# Altium schematic sheet Э3-10.SchDoc
size 594 x 420 mm; Address1: Address1; Address2: Address2; Address3: Address3; Address4: Address4; SheetNumber: 9; SheetTotal: 12; DocumentType: Схема электрическая принципиальная
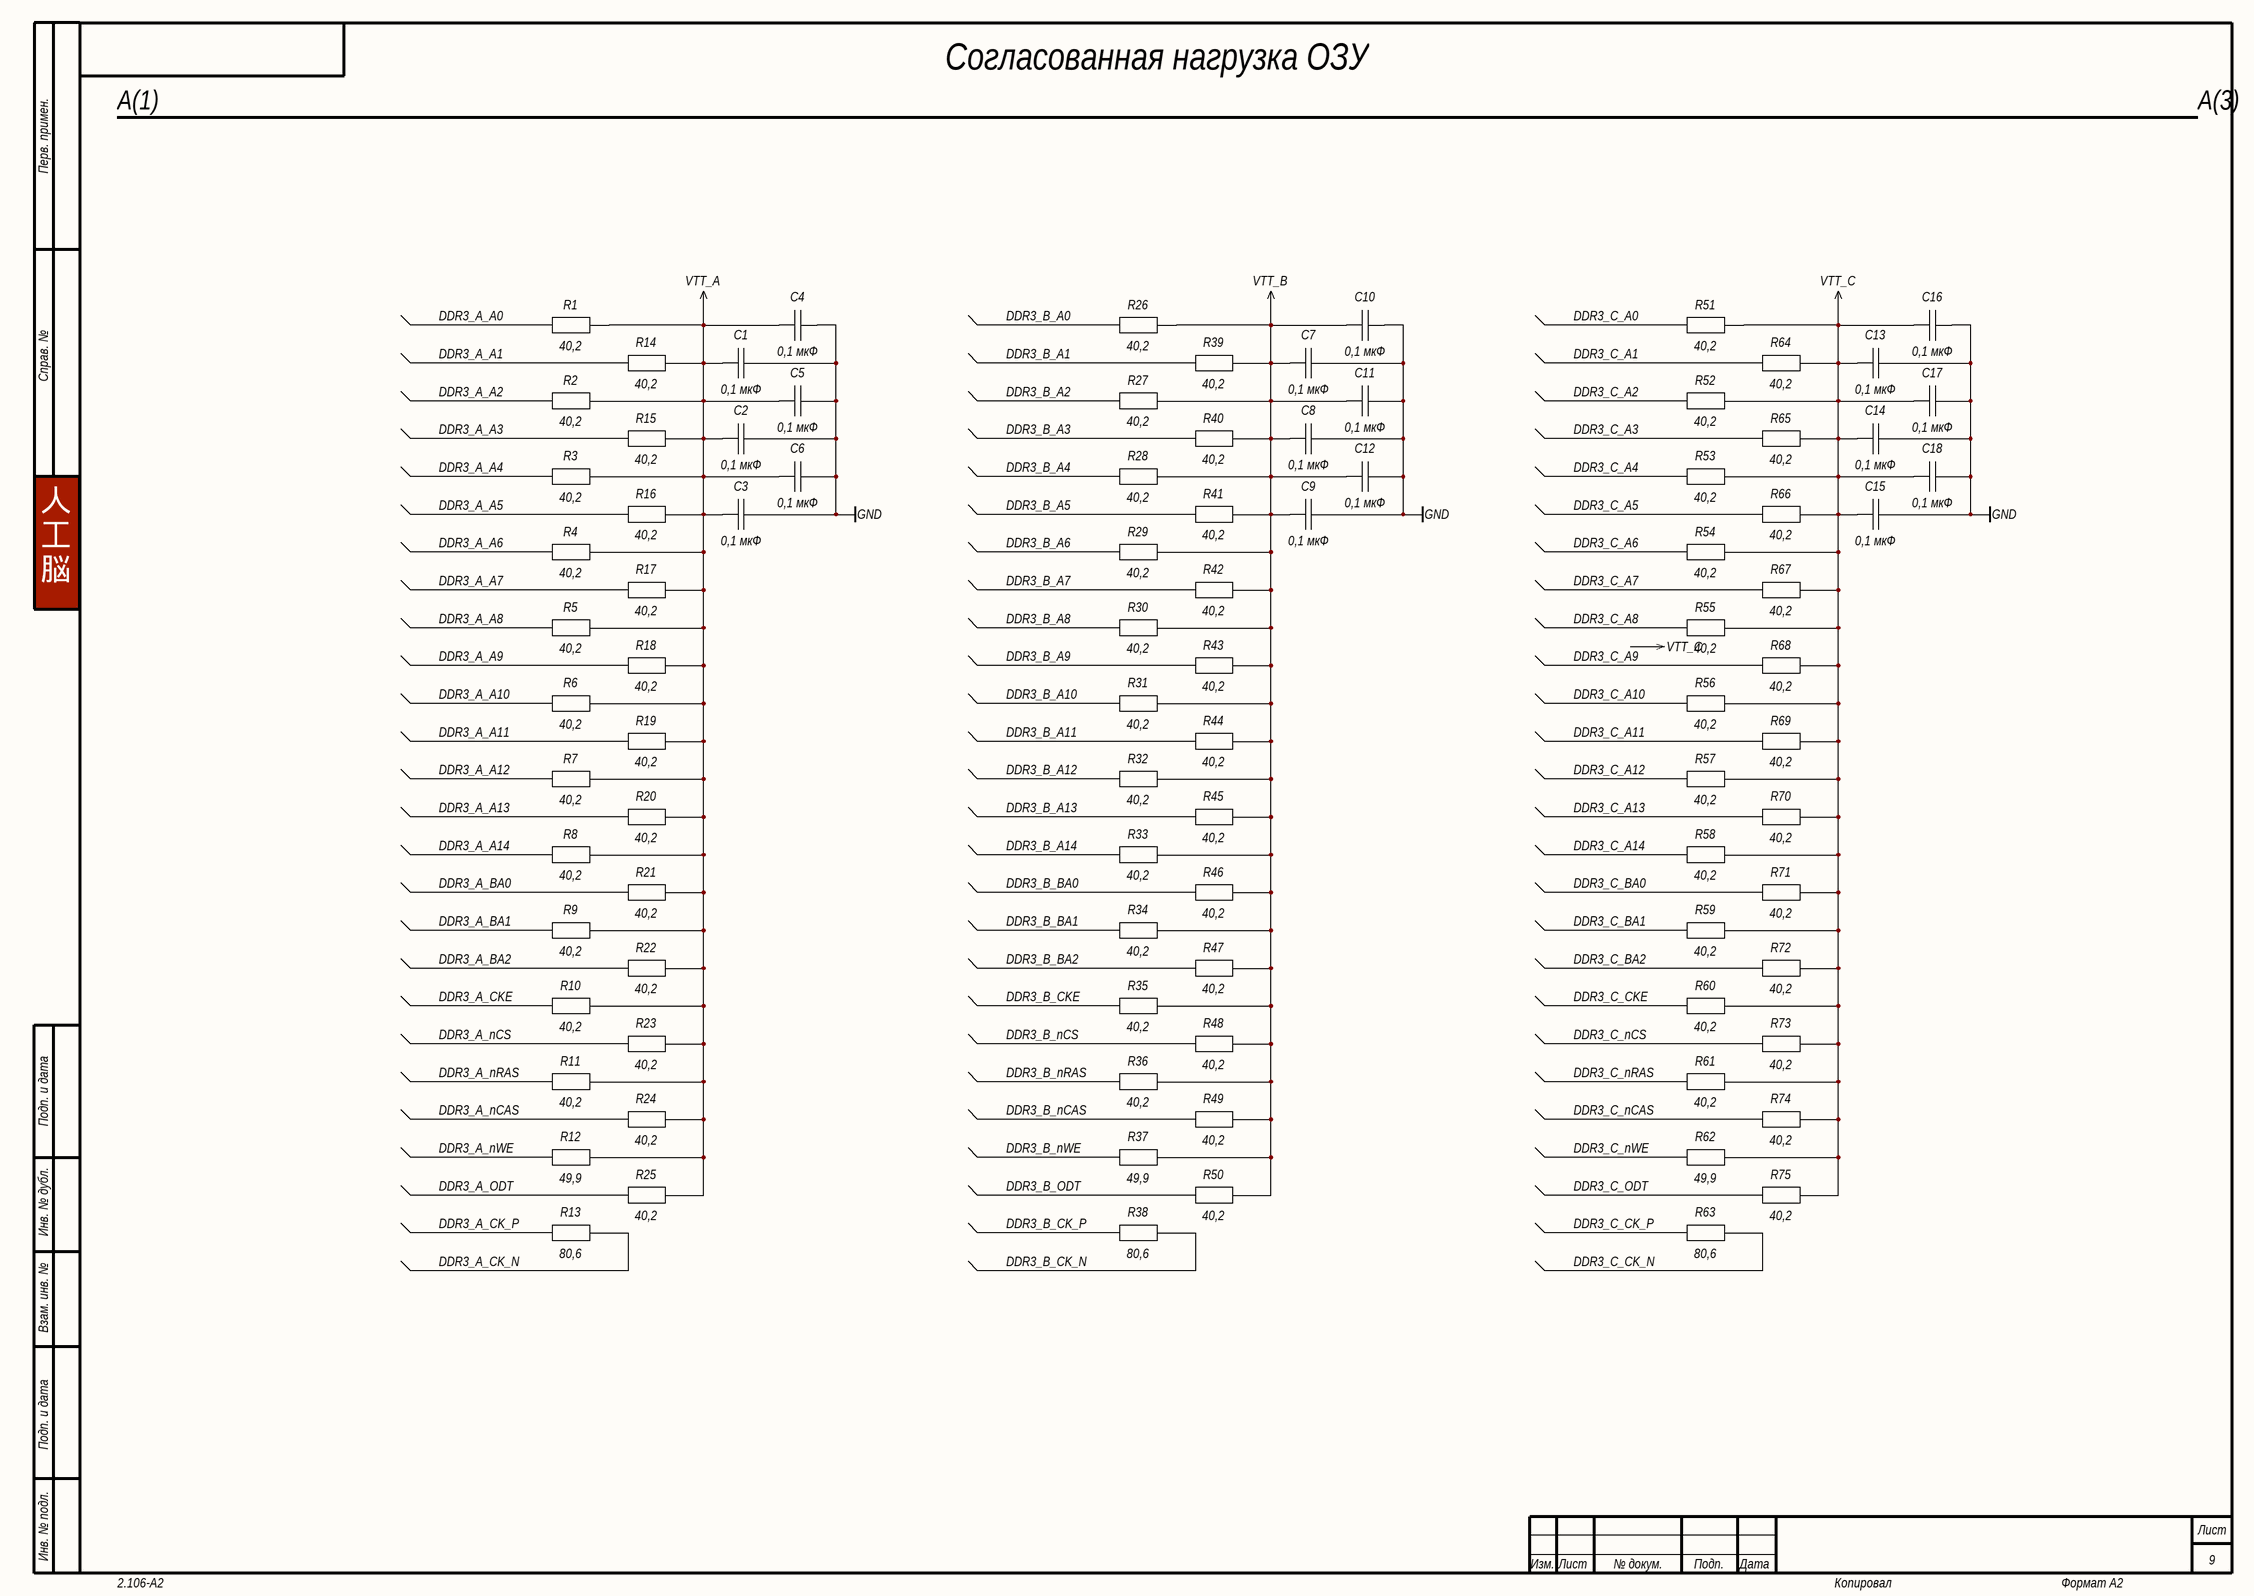
[diagram p0: Э3-10.SchDoc]

## Parts
C1  value 0,1 мкФ  [C0201-B-0.3mm]  (hidden comment: 1)
C2  value 0,1 мкФ  [C0201-B-0.3mm]  (hidden comment: 1)
C3  value 0,1 мкФ  [C0201-B-0.3mm]  (hidden comment: 1)
C4  value 0,1 мкФ  [C0201-B-0.3mm]  (hidden comment: 1)
C5  value 0,1 мкФ  [C0201-B-0.3mm]  (hidden comment: 1)
C6  value 0,1 мкФ  [C0201-B-0.3mm]  (hidden comment: 1)
C7  value 0,1 мкФ  [C0201-B-0.3mm]  (hidden comment: 1)
C8  value 0,1 мкФ  [C0201-B-0.3mm]  (hidden comment: 1)
C9  value 0,1 мкФ  [C0201-B-0.3mm]  (hidden comment: 1)
C10  value 0,1 мкФ  [C0201-B-0.3mm]  (hidden comment: 1)
C11  value 0,1 мкФ  [C0201-B-0.3mm]  (hidden comment: 1)
C12  value 0,1 мкФ  [C0201-B-0.3mm]  (hidden comment: 1)
C13  value 0,1 мкФ  [C0201-B-0.3mm]  (hidden comment: 1)
C14  value 0,1 мкФ  [C0201-B-0.3mm]  (hidden comment: 1)
C15  value 0,1 мкФ  [C0201-B-0.3mm]  (hidden comment: 1)
C16  value 0,1 мкФ  [C0201-B-0.3mm]  (hidden comment: 1)
C17  value 0,1 мкФ  [C0201-B-0.3mm]  (hidden comment: 1)
C18  value 0,1 мкФ  [C0201-B-0.3mm]  (hidden comment: 1)
R1  value 40,2  [CR0201-B-0.25mm]  (hidden comment: 1)
R2  value 40,2  [CR0201-B-0.25mm]  (hidden comment: 1)
R3  value 40,2  [CR0201-B-0.25mm]  (hidden comment: 1)
R4  value 40,2  [CR0201-B-0.25mm]  (hidden comment: 1)
R5  value 40,2  [CR0201-B-0.25mm]  (hidden comment: 1)
R6  value 40,2  [CR0201-B-0.25mm]  (hidden comment: 1)
R7  value 40,2  [CR0201-B-0.25mm]  (hidden comment: 1)
R8  value 40,2  [CR0201-B-0.25mm]  (hidden comment: 1)
R9  value 40,2  [CR0201-B-0.25mm]  (hidden comment: 1)
R10  value 40,2  [CR0201-B-0.25mm]  (hidden comment: 1)
R11  value 40,2  [CR0201-B-0.25mm]  (hidden comment: 1)
R12  value 49,9  [CR0201-B-0.25mm]  (hidden comment: 1)
R13  value 80,6  [CR0201-B-0.25mm]  (hidden comment: 1)
R14  value 40,2  [CR0201-B-0.25mm]  (hidden comment: 1)
R15  value 40,2  [CR0201-B-0.25mm]  (hidden comment: 1)
R16  value 40,2  [CR0201-B-0.25mm]  (hidden comment: 1)
R17  value 40,2  [CR0201-B-0.25mm]  (hidden comment: 1)
R18  value 40,2  [CR0201-B-0.25mm]  (hidden comment: 1)
R19  value 40,2  [CR0201-B-0.25mm]  (hidden comment: 1)
R20  value 40,2  [CR0201-B-0.25mm]  (hidden comment: 1)
R21  value 40,2  [CR0201-B-0.25mm]  (hidden comment: 1)
R22  value 40,2  [CR0201-B-0.25mm]  (hidden comment: 1)
R23  value 40,2  [CR0201-B-0.25mm]  (hidden comment: 1)
R24  value 40,2  [CR0201-B-0.25mm]  (hidden comment: 1)
R25  value 40,2  [CR0201-B-0.25mm]  (hidden comment: 1)
R26  value 40,2  [CR0201-B-0.25mm]  (hidden comment: 1)
R27  value 40,2  [CR0201-B-0.25mm]  (hidden comment: 1)
R28  value 40,2  [CR0201-B-0.25mm]  (hidden comment: 1)
R29  value 40,2  [CR0201-B-0.25mm]  (hidden comment: 1)
R30  value 40,2  [CR0201-B-0.25mm]  (hidden comment: 1)
R31  value 40,2  [CR0201-B-0.25mm]  (hidden comment: 1)
R32  value 40,2  [CR0201-B-0.25mm]  (hidden comment: 1)
R33  value 40,2  [CR0201-B-0.25mm]  (hidden comment: 1)
R34  value 40,2  [CR0201-B-0.25mm]  (hidden comment: 1)
R35  value 40,2  [CR0201-B-0.25mm]  (hidden comment: 1)
R36  value 40,2  [CR0201-B-0.25mm]  (hidden comment: 1)
R37  value 49,9  [CR0201-B-0.25mm]  (hidden comment: 1)
R38  value 80,6  [CR0201-B-0.25mm]  (hidden comment: 1)
R39  value 40,2  [CR0201-B-0.25mm]  (hidden comment: 1)
R40  value 40,2  [CR0201-B-0.25mm]  (hidden comment: 1)
R41  value 40,2  [CR0201-B-0.25mm]  (hidden comment: 1)
R42  value 40,2  [CR0201-B-0.25mm]  (hidden comment: 1)
R43  value 40,2  [CR0201-B-0.25mm]  (hidden comment: 1)
R44  value 40,2  [CR0201-B-0.25mm]  (hidden comment: 1)
R45  value 40,2  [CR0201-B-0.25mm]  (hidden comment: 1)
R46  value 40,2  [CR0201-B-0.25mm]  (hidden comment: 1)
R47  value 40,2  [CR0201-B-0.25mm]  (hidden comment: 1)
R48  value 40,2  [CR0201-B-0.25mm]  (hidden comment: 1)
R49  value 40,2  [CR0201-B-0.25mm]  (hidden comment: 1)
R50  value 40,2  [CR0201-B-0.25mm]  (hidden comment: 1)
R51  value 40,2  [CR0201-B-0.25mm]  (hidden comment: 1)
R52  value 40,2  [CR0201-B-0.25mm]  (hidden comment: 1)
R53  value 40,2  [CR0201-B-0.25mm]  (hidden comment: 1)
R54  value 40,2  [CR0201-B-0.25mm]  (hidden comment: 1)
R55  value 40,2  [CR0201-B-0.25mm]  (hidden comment: 1)
R56  value 40,2  [CR0201-B-0.25mm]  (hidden comment: 1)
R57  value 40,2  [CR0201-B-0.25mm]  (hidden comment: 1)
R58  value 40,2  [CR0201-B-0.25mm]  (hidden comment: 1)
R59  value 40,2  [CR0201-B-0.25mm]  (hidden comment: 1)
R60  value 40,2  [CR0201-B-0.25mm]  (hidden comment: 1)
R61  value 40,2  [CR0201-B-0.25mm]  (hidden comment: 1)
R62  value 49,9  [CR0201-B-0.25mm]  (hidden comment: 1)
R63  value 80,6  [CR0201-B-0.25mm]  (hidden comment: 1)
R64  value 40,2  [CR0201-B-0.25mm]  (hidden comment: 1)
R65  value 40,2  [CR0201-B-0.25mm]  (hidden comment: 1)
R66  value 40,2  [CR0201-B-0.25mm]  (hidden comment: 1)
R67  value 40,2  [CR0201-B-0.25mm]  (hidden comment: 1)
R68  value 40,2  [CR0201-B-0.25mm]  (hidden comment: 1)
R69  value 40,2  [CR0201-B-0.25mm]  (hidden comment: 1)
R70  value 40,2  [CR0201-B-0.25mm]  (hidden comment: 1)
R71  value 40,2  [CR0201-B-0.25mm]  (hidden comment: 1)
R72  value 40,2  [CR0201-B-0.25mm]  (hidden comment: 1)
R73  value 40,2  [CR0201-B-0.25mm]  (hidden comment: 1)
R74  value 40,2  [CR0201-B-0.25mm]  (hidden comment: 1)
R75  value 40,2  [CR0201-B-0.25mm]  (hidden comment: 1)

## Nets
GND: C1.2 C2.2 C3.2 C4.2 C5.2 C6.2 C7.2 C8.2 C9.2 C10.2 C11.2 C12.2 C13.2 C14.2 C15.2 C16.2 C17.2 C18.2
VTT_A: C1.1 C2.1 C3.1 C4.1 C5.1 C6.1 R1.2 R2.2 R3.2 R4.2 R5.2 R6.2 R7.2 R8.2 R9.2 R10.2 R11.2 R12.2 R14.2 R15.2 R16.2 R17.2 R18.2 R19.2 R20.2 R21.2 R22.2 R23.2 R24.2 R25.2
VTT_B: C7.1 C8.1 C9.1 C10.1 C11.1 C12.1 R26.2 R27.2 R28.2 R29.2 R30.2 R31.2 R32.2 R33.2 R34.2 R35.2 R36.2 R37.2 R39.2 R40.2 R41.2 R42.2 R43.2 R44.2 R45.2 R46.2 R47.2 R48.2 R49.2 R50.2
VTT_C: C13.1 C14.1 C15.1 C16.1 C17.1 C18.1 R51.2 R52.2 R53.2 R54.2 R55.2 R56.2 R57.2 R58.2 R59.2 R60.2 R61.2 R62.2 R64.2 R65.2 R66.2 R67.2 R68.2 R69.2 R70.2 R71.2 R72.2 R73.2 R74.2 R75.2
DDR3_A_A0: R1.1
DDR3_A_A1: R14.1
DDR3_A_A2: R2.1
DDR3_A_A3: R15.1
DDR3_A_A4: R3.1
DDR3_A_A5: R16.1
DDR3_A_A6: R4.1
DDR3_A_A7: R17.1
DDR3_A_A8: R5.1
DDR3_A_A9: R18.1
DDR3_A_A10: R6.1
DDR3_A_A11: R19.1
DDR3_A_A12: R7.1
DDR3_A_A13: R20.1
DDR3_A_A14: R8.1
DDR3_A_BA0: R21.1
DDR3_A_BA1: R9.1
DDR3_A_BA2: R22.1
DDR3_A_CK_N: R13.2
DDR3_A_CK_P: R13.1
DDR3_A_CKE: R10.1
DDR3_A_nCAS: R24.1
DDR3_A_nCS: R23.1
DDR3_A_nRAS: R11.1
DDR3_A_nWE: R12.1
DDR3_A_ODT: R25.1
DDR3_B_A0: R26.1
DDR3_B_A1: R39.1
DDR3_B_A2: R27.1
DDR3_B_A3: R40.1
DDR3_B_A4: R28.1
DDR3_B_A5: R41.1
DDR3_B_A6: R29.1
DDR3_B_A7: R42.1
DDR3_B_A8: R30.1
DDR3_B_A9: R43.1
DDR3_B_A10: R31.1
DDR3_B_A11: R44.1
DDR3_B_A12: R32.1
DDR3_B_A13: R45.1
DDR3_B_A14: R33.1
DDR3_B_BA0: R46.1
DDR3_B_BA1: R34.1
DDR3_B_BA2: R47.1
DDR3_B_CK_N: R38.2
DDR3_B_CK_P: R38.1
DDR3_B_CKE: R35.1
DDR3_B_nCAS: R49.1
DDR3_B_nCS: R48.1
DDR3_B_nRAS: R36.1
DDR3_B_nWE: R37.1
DDR3_B_ODT: R50.1
DDR3_C_A0: R51.1
DDR3_C_A1: R64.1
DDR3_C_A2: R52.1
DDR3_C_A3: R65.1
DDR3_C_A4: R53.1
DDR3_C_A5: R66.1
DDR3_C_A6: R54.1
DDR3_C_A7: R67.1
DDR3_C_A8: R55.1
DDR3_C_A9: R68.1
DDR3_C_A10: R56.1
DDR3_C_A11: R69.1
DDR3_C_A12: R57.1
DDR3_C_A13: R70.1
DDR3_C_A14: R58.1
DDR3_C_BA0: R71.1
DDR3_C_BA1: R59.1
DDR3_C_BA2: R72.1
DDR3_C_CK_N: R63.2
DDR3_C_CK_P: R63.1
DDR3_C_CKE: R60.1
DDR3_C_nCAS: R74.1
DDR3_C_nCS: R73.1
DDR3_C_nRAS: R61.1
DDR3_C_nWE: R62.1
DDR3_C_ODT: R75.1

## Notes on the sheet
- A(1)
- Согласованная нагрузка ОЗУ
- A(3)
- 人
  工
  脳
- Перв. примен.
- Справ. №
- Подп. и дата
- Инв. № дубл.
- Взам. инв. №
- Инв. № подл.
- Изм.
- Лист
- № докум.
- Подп.
- Дата
- 2.106-A2
- Копировал
- Формат А2

## Library data of the parts
C1-C18 = Non Polar Hor.: TemperatureRange: -...+°C; ComponentType: Конденсатор; Install: 1
R1-R75 = Resistor Hor.: TemperatureRange: -...+°C; ComponentType: Резистор; Install: 1